# Altium project nlink.PrjPCB
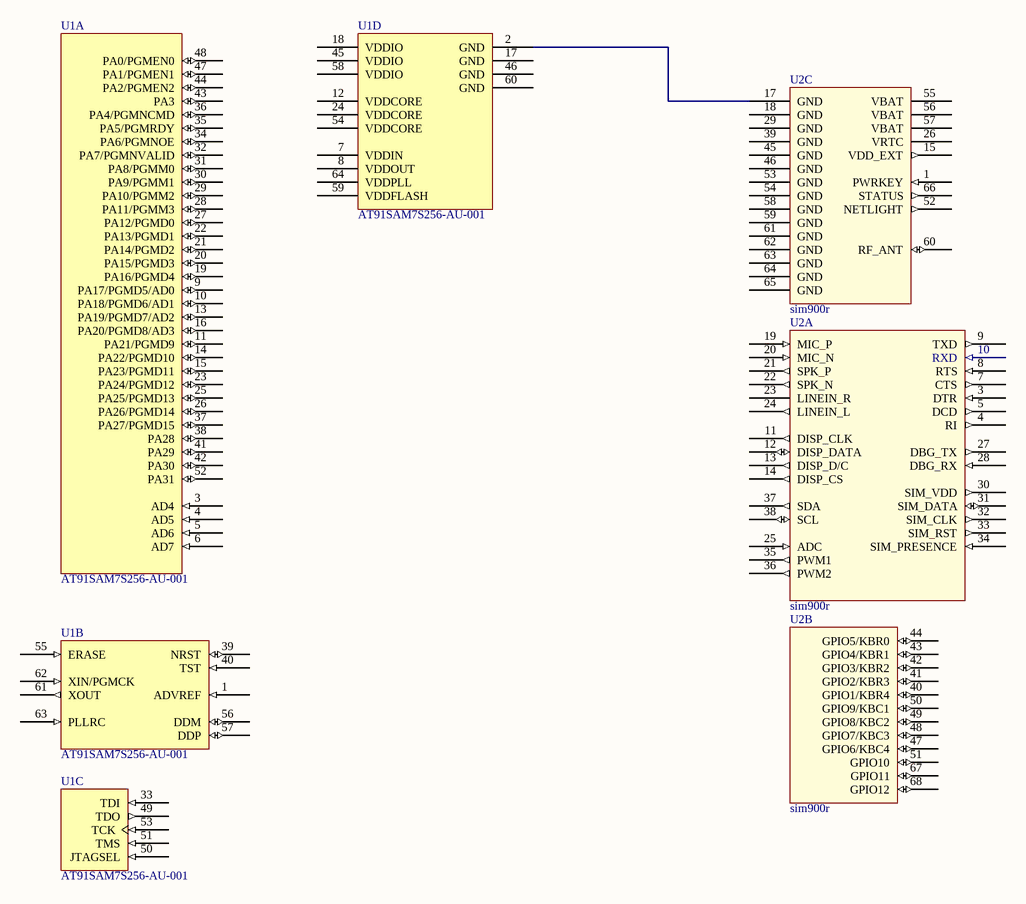
[diagram p0: nlink.SchDoc]
1 sheet, 2 parts. Net scope: global (net labels, ports and power ports of the same name join across sheets).
Board file: nlink.PcbDoc

## Sheet nlink.SchDoc
size A4

### Parts
U1  AT91SAM7S256-AU-001  [LQFP64_N]  (parts A,B,C,D of 4)
U2  sim900r  [PCBSIM900r]  (parts A,B,C of 3)

### Nets
NetU1_2: U1.2(GND) U2.17(GND)

Not connected (* = marked no-connect by the designer): U1 1(ADVREF) 3(AD4) 4(AD5) 5(AD6) 6(AD7) 7(VDDIN) 8(VDDOUT) 9(PA17/PGMD5/AD0) 10(PA18/PGMD6/AD1) 11(PA21/PGMD9) 12(VDDCORE) 13(PA19/PGMD7/AD2) 14(PA22/PGMD10) 15(PA23/PGMD11) 16(PA20/PGMD8/AD3) 17(GND) 18(VDDIO) 19(PA16/PGMD4) 20(PA15/PGMD3) 21(PA14/PGMD2) 22(PA13/PGMD1) 23(PA24/PGMD12) 24(VDDCORE) 25(PA25/PGMD13) 26(PA26/PGMD14) 27(PA12/PGMD0) 28(PA11/PGMM3) 29(PA10/PGMM2) 30(PA9/PGMM1) 31(PA8/PGMM0) 32(PA7/PGMNVALID) 33(TDI) 34(PA6/PGMNOE) 35(PA5/PGMRDY) 36(PA4/PGMNCMD) 37(PA27/PGMD15) 38(PA28) 39(NRST) 40(TST) 41(PA29) 42(PA30) 43(PA3) 44(PA2/PGMEN2) 45(VDDIO) 46(GND) 47(PA1/PGMEN1) 48(PA0/PGMEN0) 49(TDO) 50(JTAGSEL) 51(TMS) 52(PA31) 53(TCK) 54(VDDCORE) 55(ERASE) 56(DDM) 57(DDP) 58(VDDIO) 59(VDDFLASH) 60(GND) 61(XOUT) 62(XIN/PGMCK) 63(PLLRC) 64(VDDPLL); U2 1(PWRKEY) 3(DTR) 4(RI) 5(DCD) 7(CTS) 8(RTS) 9(TXD) 10(RXD) 11(DISP_CLK) 12(DISP_DATA) 13(DISP_D/C) 14(DISP_CS) 15(VDD_EXT) 18(GND) 19(MIC_P) 20(MIC_N) 21(SPK_P) 22(SPK_N) 23(LINEIN_R) 24(LINEIN_L) 25(ADC) 26(VRTC) 27(DBG_TX) 28(DBG_RX) 29(GND) 30(SIM_VDD) 31(SIM_DATA) 32(SIM_CLK) 33(SIM_RST) 34(SIM_PRESENCE) 35(PWM1) 36(PWM2) 37(SDA) 38(SCL) 39(GND) 40(GPIO1/KBR4) 41(GPIO2/KBR3) 42(GPIO3/KBR2) 43(GPIO4/KBR1) 44(GPIO5/KBR0) 45(GND) 46(GND) 47(GPIO6/KBC4) 48(GPIO7/KBC3) 49(GPIO8/KBC2) 50(GPIO9/KBC1) 51(GPIO10) 52(NETLIGHT) 53(GND) 54(GND) 55(VBAT) 56(VBAT) 57(VBAT) 58(GND) 59(GND) 60(RF_ANT) 61(GND) 62(GND) 63(GND) 64(GND) 65(GND) 66(STATUS) 67(GPIO11) 68(GPIO12)

### Library data of the parts
U1 = AT91SAM7S256-AU-001: Smart ARM Microcontroller, ARM7TDMI 32-Bit RISC CPU, 256KB Flash and 64KB SRAM, 64-Pin LQFP, Industrial, Pb-Free; Published: 16-Oct-2006; DatasheetVersion: 22-Mar-2006; PackageVersion: Apr-2006; PackageReference: LQFP64; Publisher: Altium Limited; PackageDescription: 64-Pin Thin Quad Flat Pack 0.5 mm Pitch; Code_JEDEC: MS-026-BCD; ComponentLink1Description: Manufacturer Link; ComponentLink1URL: http://www.atmel.com; ComponentLink2Description: Datasheet; ComponentLink2URL: http://www.atmel.com/dyn/resources/prod_documents/6175s.pdf